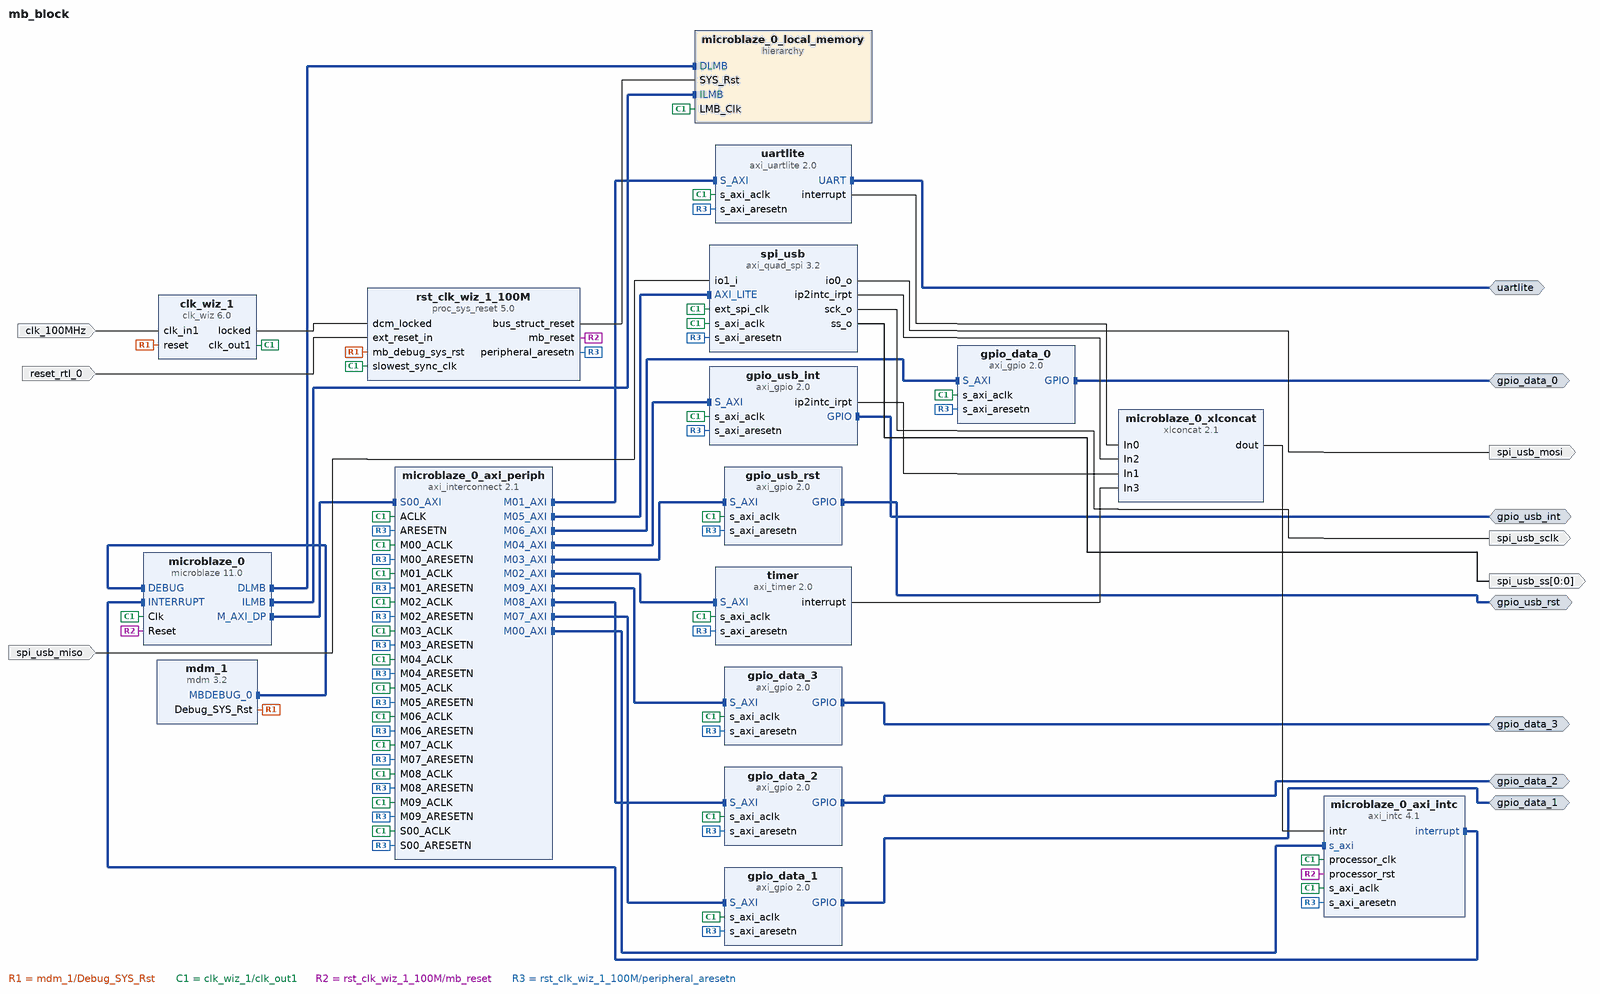
[diagram p0: block diagram of the top level]
# Vivado block design mb_block, xc7s50csga324-1, Vivado 2022.2
create_bd_design mb_block

create_bd_intf_port -mode Master -vlnv xilinx.com:interface:uart_rtl:1.0 uartlite
create_bd_intf_port -mode Master -vlnv xilinx.com:interface:gpio_rtl:1.0 gpio_usb_rst
create_bd_intf_port -mode Master -vlnv xilinx.com:interface:gpio_rtl:1.0 gpio_usb_int
create_bd_intf_port -mode Master -vlnv xilinx.com:interface:gpio_rtl:1.0 gpio_data_0
create_bd_intf_port -mode Master -vlnv xilinx.com:interface:gpio_rtl:1.0 gpio_data_1
create_bd_intf_port -mode Master -vlnv xilinx.com:interface:gpio_rtl:1.0 gpio_data_2
create_bd_intf_port -mode Master -vlnv xilinx.com:interface:gpio_rtl:1.0 gpio_data_3
create_bd_port -dir I -type clk clk_100MHz
set_property -dict {CONFIG.FREQ_HZ 100000000} [get_bd_ports clk_100MHz]
create_bd_port -dir I -type rst reset_rtl_0
set_property -dict {CONFIG.POLARITY ACTIVE_LOW} [get_bd_ports reset_rtl_0]
create_bd_port -dir O spi_usb_mosi
create_bd_port -dir I spi_usb_miso
create_bd_port -dir O spi_usb_sclk
create_bd_port -dir O -from 0 -to 0 spi_usb_ss

create_bd_cell -type ip -vlnv xilinx.com:ip:microblaze:11.0 microblaze_0
set_property -dict [list \
  CONFIG.C_DEBUG_ENABLED 1 \
  CONFIG.C_D_AXI 1 \
  CONFIG.C_D_LMB 1 \
  CONFIG.C_I_LMB 1 \
  CONFIG.G_TEMPLATE_LIST 8 \
] [get_bd_cells microblaze_0]
create_bd_cell -type hier microblaze_0_local_memory
create_bd_cell -type ip -vlnv xilinx.com:ip:axi_interconnect:2.1 microblaze_0_axi_periph
set_property -dict {CONFIG.NUM_MI 10} [get_bd_cells microblaze_0_axi_periph]
create_bd_cell -type ip -vlnv xilinx.com:ip:axi_intc:4.1 microblaze_0_axi_intc
set_property -dict {CONFIG.C_HAS_FAST 1} [get_bd_cells microblaze_0_axi_intc]
create_bd_cell -type ip -vlnv xilinx.com:ip:xlconcat:2.1 microblaze_0_xlconcat
set_property -dict {CONFIG.NUM_PORTS 4} [get_bd_cells microblaze_0_xlconcat]
create_bd_cell -type ip -vlnv xilinx.com:ip:mdm:3.2 mdm_1
create_bd_cell -type ip -vlnv xilinx.com:ip:clk_wiz:6.0 clk_wiz_1
set_property -dict {CONFIG.PRIM_SOURCE Single_ended_clock_capable_pin} [get_bd_cells clk_wiz_1]
create_bd_cell -type ip -vlnv xilinx.com:ip:proc_sys_reset:5.0 rst_clk_wiz_1_100M
create_bd_cell -type ip -vlnv xilinx.com:ip:axi_uartlite:2.0 uartlite
set_property -dict {CONFIG.C_BAUDRATE 115200} [get_bd_cells uartlite]
create_bd_cell -type ip -vlnv xilinx.com:ip:axi_gpio:2.0 gpio_usb_rst
set_property -dict {CONFIG.C_ALL_OUTPUTS 1 CONFIG.C_GPIO_WIDTH 1} [get_bd_cells gpio_usb_rst]
create_bd_cell -type ip -vlnv xilinx.com:ip:axi_gpio:2.0 gpio_usb_int
set_property -dict {CONFIG.C_ALL_INPUTS 1 CONFIG.C_GPIO_WIDTH 1 CONFIG.C_INTERRUPT_PRESENT 1} [get_bd_cells gpio_usb_int]
create_bd_cell -type ip -vlnv xilinx.com:ip:axi_timer:2.0 timer
set_property -dict {CONFIG.enable_timer2 1 CONFIG.mode_64bit 0} [get_bd_cells timer]
create_bd_cell -type ip -vlnv xilinx.com:ip:axi_quad_spi:3.2 spi_usb
set_property -dict {CONFIG.C_SCK_RATIO 4 CONFIG.C_USE_STARTUP 0} [get_bd_cells spi_usb]
create_bd_cell -type ip -vlnv xilinx.com:ip:axi_gpio:2.0 gpio_data_0
set_property -dict {CONFIG.C_ALL_OUTPUTS 1 CONFIG.C_IS_DUAL 0} [get_bd_cells gpio_data_0]
create_bd_cell -type ip -vlnv xilinx.com:ip:axi_gpio:2.0 gpio_data_1
set_property -dict {CONFIG.C_ALL_OUTPUTS 1 CONFIG.C_IS_DUAL 0} [get_bd_cells gpio_data_1]
create_bd_cell -type ip -vlnv xilinx.com:ip:axi_gpio:2.0 gpio_data_2
set_property -dict {CONFIG.C_ALL_OUTPUTS 1 CONFIG.C_IS_DUAL 0} [get_bd_cells gpio_data_2]
create_bd_cell -type ip -vlnv xilinx.com:ip:axi_gpio:2.0 gpio_data_3
set_property -dict {CONFIG.C_ALL_OUTPUTS 1 CONFIG.C_IS_DUAL 0} [get_bd_cells gpio_data_3]

# ---- hierarchy /microblaze_0_local_memory ----
current_bd_instance /microblaze_0_local_memory
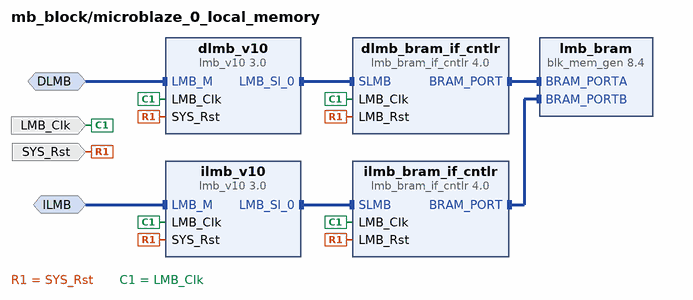
[diagram p1: block diagram inside /microblaze_0_local_memory]
create_bd_intf_pin -mode MirroredMaster -vlnv xilinx.com:interface:lmb_rtl:1.0 DLMB
create_bd_intf_pin -mode MirroredMaster -vlnv xilinx.com:interface:lmb_rtl:1.0 ILMB
create_bd_pin -dir I -type clk LMB_Clk
create_bd_pin -dir I -type rst SYS_Rst

create_bd_cell -type ip -vlnv xilinx.com:ip:lmb_v10:3.0 dlmb_v10
create_bd_cell -type ip -vlnv xilinx.com:ip:lmb_v10:3.0 ilmb_v10
create_bd_cell -type ip -vlnv xilinx.com:ip:lmb_bram_if_cntlr:4.0 dlmb_bram_if_cntlr
set_property -dict {CONFIG.C_ECC 0} [get_bd_cells dlmb_bram_if_cntlr]
create_bd_cell -type ip -vlnv xilinx.com:ip:lmb_bram_if_cntlr:4.0 ilmb_bram_if_cntlr
set_property -dict {CONFIG.C_ECC 0} [get_bd_cells ilmb_bram_if_cntlr]
create_bd_cell -type ip -vlnv xilinx.com:ip:blk_mem_gen:8.4 lmb_bram
set_property -dict {CONFIG.Memory_Type True_Dual_Port_RAM CONFIG.use_bram_block BRAM_Controller} [get_bd_cells lmb_bram]

# ---- connections ----

current_bd_instance /microblaze_0_local_memory
connect_bd_intf_net -intf_net microblaze_0_dlmb [get_bd_intf_pins DLMB] [get_bd_intf_pins dlmb_v10/LMB_M]
connect_bd_intf_net -intf_net microblaze_0_dlmb_bus [get_bd_intf_pins dlmb_v10/LMB_Sl_0] [get_bd_intf_pins dlmb_bram_if_cntlr/SLMB]
connect_bd_intf_net -intf_net microblaze_0_dlmb_cntlr [get_bd_intf_pins dlmb_bram_if_cntlr/BRAM_PORT] [get_bd_intf_pins lmb_bram/BRAM_PORTA]
connect_bd_intf_net -intf_net microblaze_0_ilmb [get_bd_intf_pins ILMB] [get_bd_intf_pins ilmb_v10/LMB_M]
connect_bd_intf_net -intf_net microblaze_0_ilmb_bus [get_bd_intf_pins ilmb_v10/LMB_Sl_0] [get_bd_intf_pins ilmb_bram_if_cntlr/SLMB]
connect_bd_intf_net -intf_net microblaze_0_ilmb_cntlr [get_bd_intf_pins ilmb_bram_if_cntlr/BRAM_PORT] [get_bd_intf_pins lmb_bram/BRAM_PORTB]
connect_bd_net [get_bd_pins SYS_Rst] \
  [get_bd_pins dlmb_v10/SYS_Rst] [get_bd_pins dlmb_bram_if_cntlr/LMB_Rst] [get_bd_pins ilmb_v10/SYS_Rst] \
  [get_bd_pins ilmb_bram_if_cntlr/LMB_Rst]
connect_bd_net -net microblaze_0_Clk [get_bd_pins LMB_Clk] \
  [get_bd_pins dlmb_v10/LMB_Clk] [get_bd_pins dlmb_bram_if_cntlr/LMB_Clk] [get_bd_pins ilmb_v10/LMB_Clk] \
  [get_bd_pins ilmb_bram_if_cntlr/LMB_Clk]
set_property HDL_ATTRIBUTE.BMM_INFO_ADDRESS_SPACE {byte  0x00000000 32 > mb_block microblaze_0_local_memory/lmb_bram} [get_bd_cells dlmb_bram_if_cntlr]
set_property HDL_ATTRIBUTE.KEEP_HIERARCHY yes [get_bd_cells dlmb_bram_if_cntlr]

current_bd_instance /
connect_bd_intf_net -intf_net axi_uartlite_0_UART [get_bd_intf_ports uartlite] [get_bd_intf_pins uartlite/UART]
connect_bd_intf_net [get_bd_intf_ports gpio_data_0] [get_bd_intf_pins gpio_data_0/GPIO]
connect_bd_intf_net [get_bd_intf_ports gpio_data_1] [get_bd_intf_pins gpio_data_1/GPIO]
connect_bd_intf_net [get_bd_intf_ports gpio_data_2] [get_bd_intf_pins gpio_data_2/GPIO]
connect_bd_intf_net [get_bd_intf_ports gpio_data_3] [get_bd_intf_pins gpio_data_3/GPIO]
connect_bd_intf_net [get_bd_intf_ports gpio_usb_int] [get_bd_intf_pins gpio_usb_int/GPIO]
connect_bd_intf_net [get_bd_intf_ports gpio_usb_rst] [get_bd_intf_pins gpio_usb_rst/GPIO]
connect_bd_intf_net -intf_net microblaze_0_axi_dp [get_bd_intf_pins microblaze_0_axi_periph/S00_AXI] [get_bd_intf_pins microblaze_0/M_AXI_DP]
connect_bd_intf_net [get_bd_intf_pins microblaze_0_axi_periph/M01_AXI] [get_bd_intf_pins uartlite/S_AXI]
connect_bd_intf_net [get_bd_intf_pins timer/S_AXI] [get_bd_intf_pins microblaze_0_axi_periph/M02_AXI]
connect_bd_intf_net [get_bd_intf_pins microblaze_0_axi_periph/M03_AXI] [get_bd_intf_pins gpio_usb_rst/S_AXI]
connect_bd_intf_net [get_bd_intf_pins microblaze_0_axi_periph/M04_AXI] [get_bd_intf_pins gpio_usb_int/S_AXI]
connect_bd_intf_net [get_bd_intf_pins microblaze_0_axi_periph/M05_AXI] [get_bd_intf_pins spi_usb/AXI_LITE]
connect_bd_intf_net [get_bd_intf_pins microblaze_0_axi_periph/M06_AXI] [get_bd_intf_pins gpio_data_0/S_AXI]
connect_bd_intf_net [get_bd_intf_pins microblaze_0_axi_periph/M07_AXI] [get_bd_intf_pins gpio_data_1/S_AXI]
connect_bd_intf_net [get_bd_intf_pins microblaze_0_axi_periph/M08_AXI] [get_bd_intf_pins gpio_data_2/S_AXI]
connect_bd_intf_net [get_bd_intf_pins microblaze_0_axi_periph/M09_AXI] [get_bd_intf_pins gpio_data_3/S_AXI]
connect_bd_intf_net [get_bd_intf_pins mdm_1/MBDEBUG_0] [get_bd_intf_pins microblaze_0/DEBUG]
connect_bd_intf_net [get_bd_intf_pins microblaze_0/DLMB] [get_bd_intf_pins microblaze_0_local_memory/DLMB]
connect_bd_intf_net [get_bd_intf_pins microblaze_0/ILMB] [get_bd_intf_pins microblaze_0_local_memory/ILMB]
connect_bd_intf_net -intf_net microblaze_0_intc_axi [get_bd_intf_pins microblaze_0_axi_periph/M00_AXI] [get_bd_intf_pins microblaze_0_axi_intc/s_axi]
connect_bd_intf_net [get_bd_intf_pins microblaze_0_axi_intc/interrupt] [get_bd_intf_pins microblaze_0/INTERRUPT]
connect_bd_net -net axi_uartlite_0_interrupt [get_bd_pins uartlite/interrupt] [get_bd_pins microblaze_0_xlconcat/In0]
connect_bd_net [get_bd_ports clk_100MHz] [get_bd_pins clk_wiz_1/clk_in1]
connect_bd_net [get_bd_pins clk_wiz_1/locked] [get_bd_pins rst_clk_wiz_1_100M/dcm_locked]
connect_bd_net [get_bd_pins gpio_usb_int/ip2intc_irpt] [get_bd_pins microblaze_0_xlconcat/In1]
connect_bd_net [get_bd_pins mdm_1/Debug_SYS_Rst] [get_bd_pins rst_clk_wiz_1_100M/mb_debug_sys_rst] [get_bd_pins clk_wiz_1/reset]
connect_bd_net -net microblaze_0_Clk [get_bd_pins clk_wiz_1/clk_out1] \
  [get_bd_pins microblaze_0/Clk] [get_bd_pins microblaze_0_axi_periph/ACLK] [get_bd_pins microblaze_0_axi_periph/S00_ACLK] \
  [get_bd_pins microblaze_0_axi_periph/M00_ACLK] [get_bd_pins microblaze_0_axi_intc/s_axi_aclk] \
  [get_bd_pins microblaze_0_axi_intc/processor_clk] [get_bd_pins microblaze_0_local_memory/LMB_Clk] \
  [get_bd_pins rst_clk_wiz_1_100M/slowest_sync_clk] [get_bd_pins uartlite/s_axi_aclk] \
  [get_bd_pins microblaze_0_axi_periph/M01_ACLK] [get_bd_pins microblaze_0_axi_periph/M02_ACLK] \
  [get_bd_pins gpio_usb_rst/s_axi_aclk] [get_bd_pins microblaze_0_axi_periph/M03_ACLK] [get_bd_pins gpio_usb_int/s_axi_aclk] \
  [get_bd_pins microblaze_0_axi_periph/M04_ACLK] [get_bd_pins spi_usb/s_axi_aclk] \
  [get_bd_pins microblaze_0_axi_periph/M05_ACLK] [get_bd_pins timer/s_axi_aclk] [get_bd_pins spi_usb/ext_spi_clk] \
  [get_bd_pins microblaze_0_axi_periph/M06_ACLK] [get_bd_pins gpio_data_0/s_axi_aclk] [get_bd_pins gpio_data_1/s_axi_aclk] \
  [get_bd_pins microblaze_0_axi_periph/M07_ACLK] [get_bd_pins gpio_data_2/s_axi_aclk] \
  [get_bd_pins microblaze_0_axi_periph/M08_ACLK] [get_bd_pins gpio_data_3/s_axi_aclk] \
  [get_bd_pins microblaze_0_axi_periph/M09_ACLK]
connect_bd_net -net microblaze_0_intr [get_bd_pins microblaze_0_xlconcat/dout] [get_bd_pins microblaze_0_axi_intc/intr]
connect_bd_net -net reset_rtl_0_1 [get_bd_ports reset_rtl_0] [get_bd_pins rst_clk_wiz_1_100M/ext_reset_in]
connect_bd_net [get_bd_pins rst_clk_wiz_1_100M/bus_struct_reset] [get_bd_pins microblaze_0_local_memory/SYS_Rst]
connect_bd_net [get_bd_pins rst_clk_wiz_1_100M/mb_reset] [get_bd_pins microblaze_0/Reset] [get_bd_pins microblaze_0_axi_intc/processor_rst]
connect_bd_net [get_bd_pins rst_clk_wiz_1_100M/peripheral_aresetn] \
  [get_bd_pins microblaze_0_axi_periph/ARESETN] [get_bd_pins microblaze_0_axi_periph/S00_ARESETN] \
  [get_bd_pins microblaze_0_axi_periph/M00_ARESETN] [get_bd_pins microblaze_0_axi_intc/s_axi_aresetn] \
  [get_bd_pins uartlite/s_axi_aresetn] [get_bd_pins microblaze_0_axi_periph/M01_ARESETN] \
  [get_bd_pins microblaze_0_axi_periph/M02_ARESETN] [get_bd_pins gpio_usb_rst/s_axi_aresetn] \
  [get_bd_pins microblaze_0_axi_periph/M03_ARESETN] [get_bd_pins gpio_usb_int/s_axi_aresetn] \
  [get_bd_pins microblaze_0_axi_periph/M04_ARESETN] [get_bd_pins spi_usb/s_axi_aresetn] \
  [get_bd_pins microblaze_0_axi_periph/M05_ARESETN] [get_bd_pins timer/s_axi_aresetn] \
  [get_bd_pins microblaze_0_axi_periph/M06_ARESETN] [get_bd_pins gpio_data_0/s_axi_aresetn] \
  [get_bd_pins gpio_data_1/s_axi_aresetn] [get_bd_pins microblaze_0_axi_periph/M07_ARESETN] \
  [get_bd_pins gpio_data_2/s_axi_aresetn] [get_bd_pins microblaze_0_axi_periph/M08_ARESETN] \
  [get_bd_pins gpio_data_3/s_axi_aresetn] [get_bd_pins microblaze_0_axi_periph/M09_ARESETN]
connect_bd_net [get_bd_pins spi_usb/io0_o] [get_bd_ports spi_usb_mosi]
connect_bd_net [get_bd_pins spi_usb/ip2intc_irpt] [get_bd_pins microblaze_0_xlconcat/In2]
connect_bd_net [get_bd_pins spi_usb/sck_o] [get_bd_ports spi_usb_sclk]
connect_bd_net [get_bd_pins spi_usb/ss_o] [get_bd_ports spi_usb_ss]
connect_bd_net -net timer_usb_interrupt [get_bd_pins timer/interrupt] [get_bd_pins microblaze_0_xlconcat/In3]
connect_bd_net -net usb_spi_miso_1 [get_bd_ports spi_usb_miso] [get_bd_pins spi_usb/io1_i]
set_property HDL_ATTRIBUTE.BMM_INFO_PROCESSOR {microblaze-le > mb_block microblaze_0_local_memory/dlmb_bram_if_cntlr} [get_bd_cells microblaze_0]
set_property HDL_ATTRIBUTE.KEEP_HIERARCHY yes [get_bd_cells microblaze_0]

# ---- address map ----
assign_bd_address -offset 0x00000000 -range 128K -target_address_space [get_bd_addr_spaces microblaze_0/Data] [get_bd_addr_segs microblaze_0_local_memory/dlmb_bram_if_cntlr/SLMB/Mem]
assign_bd_address -offset 0x40000000 -range 64K -target_address_space [get_bd_addr_spaces microblaze_0/Data] [get_bd_addr_segs gpio_usb_rst/S_AXI/Reg]
assign_bd_address -offset 0x40010000 -range 64K -target_address_space [get_bd_addr_spaces microblaze_0/Data] [get_bd_addr_segs gpio_usb_int/S_AXI/Reg]
assign_bd_address -offset 0x40020000 -range 64K -target_address_space [get_bd_addr_spaces microblaze_0/Data] [get_bd_addr_segs gpio_data_0/S_AXI/Reg]
assign_bd_address -offset 0x40030000 -range 64K -target_address_space [get_bd_addr_spaces microblaze_0/Data] [get_bd_addr_segs gpio_data_1/S_AXI/Reg]
assign_bd_address -offset 0x40040000 -range 64K -target_address_space [get_bd_addr_spaces microblaze_0/Data] [get_bd_addr_segs gpio_data_2/S_AXI/Reg]
assign_bd_address -offset 0x40050000 -range 64K -target_address_space [get_bd_addr_spaces microblaze_0/Data] [get_bd_addr_segs gpio_data_3/S_AXI/Reg]
assign_bd_address -offset 0x40600000 -range 64K -target_address_space [get_bd_addr_spaces microblaze_0/Data] [get_bd_addr_segs uartlite/S_AXI/Reg]
assign_bd_address -offset 0x41200000 -range 64K -target_address_space [get_bd_addr_spaces microblaze_0/Data] [get_bd_addr_segs microblaze_0_axi_intc/S_AXI/Reg]
assign_bd_address -offset 0x41C00000 -range 64K -target_address_space [get_bd_addr_spaces microblaze_0/Data] [get_bd_addr_segs timer/S_AXI/Reg]
assign_bd_address -offset 0x44A00000 -range 64K -target_address_space [get_bd_addr_spaces microblaze_0/Data] [get_bd_addr_segs spi_usb/AXI_LITE/Reg]
assign_bd_address -offset 0x00000000 -range 128K -target_address_space [get_bd_addr_spaces microblaze_0/Instruction] [get_bd_addr_segs microblaze_0_local_memory/ilmb_bram_if_cntlr/SLMB/Mem]

validate_bd_design
save_bd_design
